# Altium project LedControl.PrjPcb
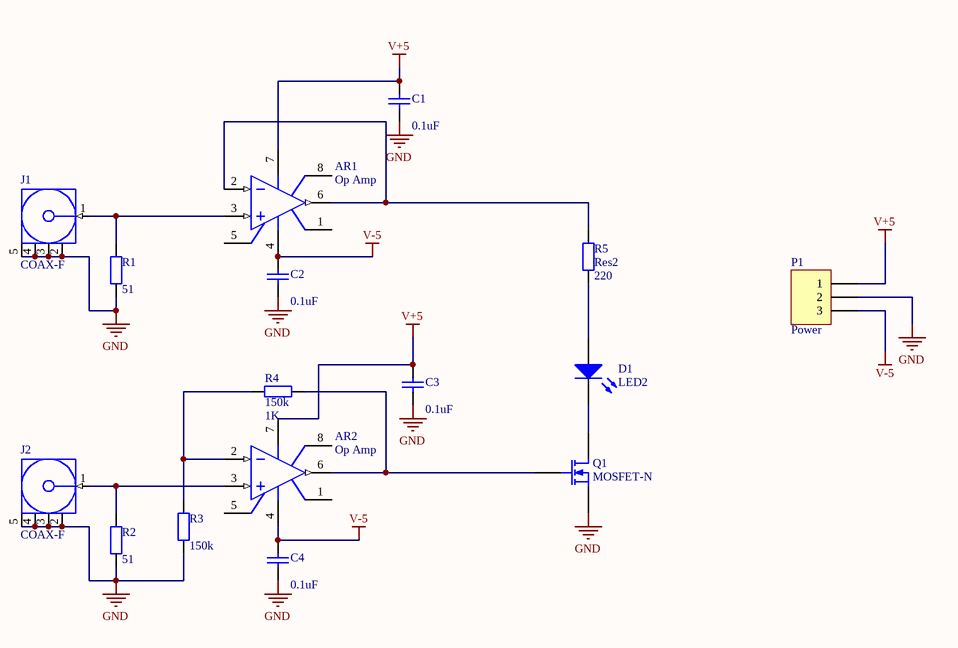
[diagram p0: LedControl.SchDoc]
1 sheet, 16 parts. Net scope: global (net labels, ports and power ports of the same name join across sheets).

## Sheet LedControl.SchDoc
size A4; SheetNumber: 1; SheetTotal: 1; SPICEModelCacheRBRDTJEW: <root> / <DocumentId>RBRDTJEW</DocumentId> / <CacheFrame Number="0"> / <Model Name="ad645a" Kind="CKT"> / <Text>* AD645A SPICE Macro-model                  4/92, Rev. B / *                                           JCB / PMI / * / * Revision History: / *     Rev. B:  Converted model to include noise analysis. / * / * This version of the AD645 model simulates the worst case / * parameters of the 'A' grade.  The worst case parameters / * used correspond to those in the data sheet. / * / * Copyright 1990 by Analog Devices, Inc. / * / * Refer to "README.DOC" file for License Statement.  Use of this model / * indicates your acceptance with the terms and provisions in the License Statement. / * / * Node assignments / *                non-inverting input / *                |   inverting input / *                |   |   positive supply / *                |   |   |   negative supply / *                |   |   |   |   output / *                |   |   |   |   | / .SUBCKT AD645A   1   2   99  50  30 / * / * INPUT STAGE &amp; POLE AT 40 MHZ / * / R3   5  50    1.049 / R4   6  50    1.049 / CIN  1   2    1E-12 / C2   5   6    1.90E-9 / I1   99  4    100E-3 / IOS  1   2    0.5E-12 / EOS  65  1    POLY(1)  17 24  500E-6  1 / J1   5   2    4   JX / J2   6   7    4   JX / EN   7  65    43  0  1 / GN1  0   1    47  0  1E-6 / GN2  0   2    61  0  1E-6 / GB1  2  50    POLY(3) 4,2 5,2 50,2 0 1E-12 1E-12 1E-12 / GB2  7  50    POLY(3) 4,7 6,7 50,7 0 1E-12 1E-12 1E-12 / * / EREF 98  0    24  0   1 / * / * VOLTAGE NOISE GENERATOR / * / VN1  41  0    DC 2 / RS1  41 42    11.8E3 / RS2  42 43    1.2E9 / CS1  42 43    79.8E-11 / RS3  43 44    1.2E9 / CS2  43 44    79.8E-11 / RS4  44 45    11.8E3 / VN2  0  45    DC 2 / * / * CURRENT NOISE GENERATOR / * / VN3  46  0    DC 2 / RN5  46 47    144 / RN6  47 48    144 / VN4  0  48    DC 2 / * / * CURRENT NOISE GENERATOR / * / VN5  60  0    DC 2 / RN7  60 61    144 / RN8  61 62    144 / VN6  0  62    DC 2 / * / * SECOND STAGE &amp; POLE AT 3 HZ / * / R5   9  98    5.26E5 / C3   9  98    1.00E-7 / G1   98  9    5  6  9.53E-1 / V2   99  8    4.7 / V3   10 50    4.7 / D1   9   8    DX / D2   10  9    DX / * / * NEGATIVE ZERO AT 15 MHZ / * / R6   11 12     1E6 / C4   11 12     -10.6E-15 / R7   12 98     1 / E2   11 98     9  24  1E6 / * / * POLE AT 40 MHZ / * / R8   13 98     1E3 / C5   13 98     3.98E-12 / G2   98 13     12 24  1E-3 / * / * POLE AT 40 MHZ / * / R9   14 98     1E3 / C6   14 98     3.98E-12 / G3   98 14     13 24  1E-3 / * / * POLE AT 40 MHZ / * / R10  15 98     1E3 / C7   15 98     3.98E-12 / G4   98 15     14 24  1E-3 / * / * COMMON-MODE GAIN NETWORK WITH ZERO AT 600 HZ / * / R11  16 17     1E6 / C8   16 17     2.65E-10 / R12  17 98     1 / E3   16 98     POLY(2) 1  98  2  98  0  15.8  15.8 / * / * POLE AT 40 MHZ / * / R13  18 98     1E3 / C9   18 98     3.98E-12 / G5   98 18     15 24  1E-3 / * / * OUTPUT STAGE / * / R14  24 99     2000E3 / R15  24 50     2000E3 / ISY  99 50     -96.5E-3 / R16  29 99     360 / R17  29 50     360 / L1   29 30     1E-8 / G6   27 50     18 29  2.78E-3 / G7   28 50     29 18  2.78E-3 / G8   29 99     99 18  2.78E-3 / G9   50 29     18 50  2.78E-3 / V4   25 29     2.0 / V5   29 26     2.0 / D3   18 25     DX / D4   26 18     DX / D5   99 27     DX / D6   99 28     DX / D7   50 27     DY / D8   50 28     DY / F1   29  0     V4  1 / F2   0  29     V5  1 / * / * MODELS USED / * / .MODEL JX PJF(BETA=4.54  VTO=-2.000  IS=2.5E-12 RD=0.1 / + RS=0.1 CGD=1E-15 CGS=1E-15) / .MODEL DX   D(IS=1E-15 RS=10 CJO=1E-15) / .MODEL DY   D(IS=1E-15 BV=50 RS=10 CJO=1E-15) / .MODEL DEN  D(IS=1E-12 RS=7409.6 KF=2.051E-15 AF=1) / .MODEL DIN  D(IS=1E-12 RS=41.5 KF=0 AF=1) / .ENDS AD645A</Text> / </Model> / <Model Name="nmos" Kind="MDL"> / <Text>*Default N-Channel MOSFET / *Pinout: D,G,S / .MODEL NMOS NMOS()</Text> / </Model> / <Model Name="led2" Kind="MDL"> / <Text>*Typ RED,GREEN,YELLOW,AMBER GaAs LED: Vf=2.1V Vr=4V If=40mA trr=3uS / *LED Pinout: 1=A, 2=K / .MODEL LED2 D (IS=93.1P RS=42M N=4.61 BV=4 IBV=10U / + CJO=2.97P VJ=.75 M=.333 TT=4.32U)</Text> / </Model> / </CacheFrame> / </root>

### Parts
AR1  Op Amp  [H-08A]
AR2  Op Amp  [H-08A]
C1  value 0.1uF  [RAD-0.3]
C2  value 0.1uF  [RAD-0.3]
C3  value 0.1uF  [RAD-0.3]
C4  value 0.1uF  [RAD-0.3]
D1  LED2  [3.2X1.6X1.1]
J1  COAX-F  [MCX5.08-H5]
J2  COAX-F  [MCX5.08-H5]
P1  Power  [HDR1X3]
Q1  MOSFET-N  [E3]
R1  value 51  [AXIAL-0.4]
R2  value 51  [AXIAL-0.4]
R3  value 150k  [AXIAL-0.4]
R4  150k  value 1K  [AXIAL-0.4]
R5  Res2  value 220  [AXIAL-0.4]

### Nets
GND: C1.1 C2.1 C3.1 C4.1 J1.2(GND) J1.3(GND) J1.4(GND) J1.5(GND) J2.2(GND) J2.3(GND) J2.4(GND) J2.5(GND) P1.2 Q1.3(S) R1.1 R2.1 R3.1
V+5: AR1.7(V+) AR2.7(V+) C1.2 C3.2 P1.1
V-5: AR1.4(V-) AR2.4(V-) C2.2 C4.2 P1.3
NetAR1_2: AR1.2(IN-) AR1.6(OUT) R5.2
NetAR1_3: AR1.3(IN+) J1.1(Signal) R1.2
NetAR2_2: AR2.2(IN-) R3.2 R4.1
NetAR2_3: AR2.3(IN+) J2.1(Signal) R2.2
NetAR2_6: AR2.6(OUT) Q1.2(G) R4.2
NetD1_1: D1.1(A) R5.1
NetD1_2: D1.2(K) Q1.1(D)

Not connected (* = marked no-connect by the designer): AR1 1(OS_NUL) 5(OS_NUL) 8(TAB); AR2 1(OS_NUL) 5(OS_NUL) 8(TAB)

### Library data of the parts
AR1 AR2 = Op Amp: FET Operational Amplifier; Published: 8-Jun-2000; LatestRevisionDate: 17-Jul-2002; LatestRevisionNote: Re-released for DXP Platform.; DatasheetVersion: REV. B; PackageVersion: 1990; PackageReference: H-08A; Publisher: Altium Limited; PackageDescription: Can; 8 Leads; Pin Circle Dia. 5.08 mm; Lead Dia. 0.53 mm (max); ComponentLink1Description: Manufacturer Link; ComponentLink1URL: http://www.analog.com/
C1-C4 = Cap: Capacitor; Published: 8-Jun-2000; LatestRevisionDate: 17-Jul-2002; LatestRevisionNote: Re-released for DXP Platform.; PackageReference: RAD-0.3; Publisher: Altium Limited; PackageDescription: Radial Cap, Thru-Hole; 2 Leads; 0.3 in Pin Spacing
D1 = LED2: Typical RED, GREEN, YELLOW, AMBER GaAs LED; Published: 8-Jun-2000; LatestRevisionDate: 17-Jul-2002; LatestRevisionNote: Re-released for DXP Platform.; PackageVersion: Feb-2002; PackageReference: 3.2X1.6X1.1; Publisher: Altium Limited; PackageDescription: SM LED; 2 Flat Leads
J1 J2 = COAX-F: RF Coaxial PCB Connector, MCX; Thru-Hole, Right-Angle Mount Socket, Blunt Post Terminal, 50 Ohm Impedance; PCB_Layout: Complies with manufacturer's recommendation.; DrillSize: Corresponds to nominal value.; Published: 15-Jul-2004; LatestRevisionDate: 15-Jul-2004; LatestRevisionNote: Component Replaced.; DatasheetDocument: 30-May-2003; PackageDocument: 04-Jul-1999; PackageReference: 919-119J-51AX; Publisher: Altium Limited; ComponentLink1Description: Manufacturer Link; ComponentLink1URL: http://www.amphenolrf.com/
P1 = Header 3: Header, 3-Pin; LatestRevisionDate: 17-Jul-2002; LatestRevisionNote: Re-released for DXP Platform.; Publisher: Altium Limited
Q1 = MOSFET-N: N-Channel MOSFET; Published: 8-Jun-2000; LatestRevisionDate: 17-Jul-2002; LatestRevisionNote: Re-released for DXP Platform.; PackageVersion: 1995/1996; PackageReference: E3; Publisher: Altium Limited; PackageDescription: TO, Flat Index; 3 In-Line, Axial Leads; Body Dia. 4.6mm; Lead Dia. 0.5 mm (max)
R1-R5 = Res2: Resistor; Published: 8-Jun-2000; LatestRevisionDate: 17-Jul-2002; LatestRevisionNote: Re-released for DXP Platform.; PackageReference: AXIAL-0.4; Publisher: Altium Limited; PackageDescription: Axial Device, Thru-Hole; 2 Leads; 0.4 in Pin Spacing